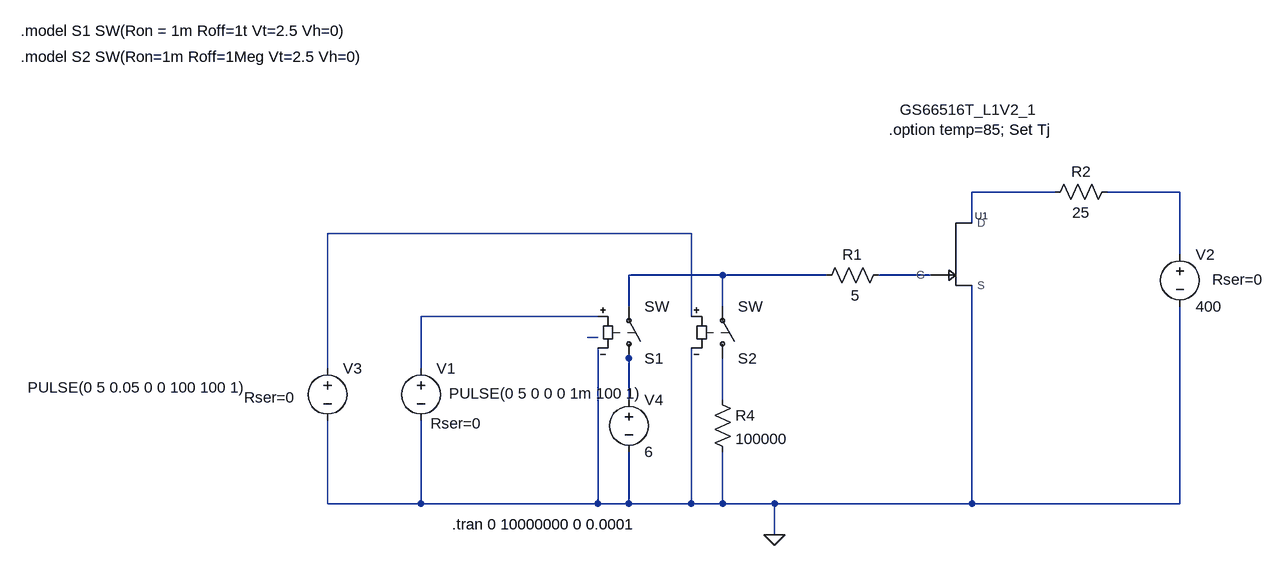
[diagram p0: schematic FloatingGate.asc]
FloatingGate.asc, the LTspice schematic file:
Version 4
SHEET 1 1036 680
WIRE 704 -96 576 -96
WIRE 896 -96 784 -96
WIRE 576 -48 576 -96
WIRE 144 -32 -416 -32
WIRE 896 0 896 -96
WIRE 192 32 48 32
WIRE 352 32 192 32
WIRE 512 32 432 32
WIRE 48 80 48 32
WIRE 192 80 192 32
WIRE 0 96 -272 96
WIRE 144 96 144 -32
WIRE 0 128 -16 128
WIRE 48 160 48 144
WIRE -416 176 -416 -32
WIRE -272 176 -272 96
WIRE 48 224 48 160
WIRE 192 224 192 160
WIRE -416 384 -416 256
WIRE -272 384 -272 256
WIRE -272 384 -416 384
WIRE 0 384 0 144
WIRE 0 384 -272 384
WIRE 48 384 48 304
WIRE 48 384 0 384
WIRE 144 384 144 144
WIRE 144 384 48 384
WIRE 192 384 192 304
WIRE 192 384 144 384
WIRE 272 384 192 384
WIRE 576 384 576 48
WIRE 576 384 272 384
WIRE 896 384 896 80
WIRE 896 384 576 384
WIRE 272 432 272 384
FLAG 272 432 0
SYMBOL GaN_E-HEMT_LT_GS66516T_L1V2_1 528 0 R0
WINDOW 3 44 -223 Center 2
SYMATTR InstName U1
SYMBOL res 448 16 R90
WINDOW 0 0 56 VBottom 2
WINDOW 3 32 52 VTop 2
SYMATTR InstName R1
SYMATTR Value 5
SYMBOL res 800 -112 R90
WINDOW 0 0 56 VBottom 2
WINDOW 3 32 56 VTop 2
SYMATTR InstName R2
SYMATTR Value 25
SYMBOL voltage -272 160 R0
WINDOW 123 0 0 Left 0
WINDOW 39 15 100 Left 2
WINDOW 3 43 54 Left 2
SYMATTR SpiceLine Rser=0
SYMATTR Value PULSE(0 5 0 0 0 1m 100 1)
SYMATTR InstName V1
SYMBOL voltage 896 -16 R0
WINDOW 123 0 0 Left 0
WINDOW 39 50 55 Left 2
SYMATTR SpiceLine Rser=0
SYMATTR InstName V2
SYMATTR Value 400
SYMBOL voltage -416 160 R0
WINDOW 123 0 0 Left 0
WINDOW 39 -128 60 Left 2
WINDOW 3 -461 45 Left 2
SYMATTR SpiceLine Rser=0
SYMATTR Value PULSE(0 5 0.05 0 0 100 100 1)
SYMATTR InstName V3
SYMBOL sw 48 176 M180
SYMATTR InstName S1
SYMATTR SpiceModel S1
SYMBOL sw 192 176 M180
SYMATTR InstName S2
SYMATTR SpiceModel S2
SYMBOL voltage 48 208 R0
WINDOW 123 0 0 Left 0
WINDOW 39 24 124 Left 2
SYMATTR InstName V4
SYMATTR Value 6
SYMBOL res 176 208 R0
SYMATTR InstName R4
SYMATTR Value 100000
TEXT 448 -192 Left 2 !.option temp=85; Set Tj
TEXT -224 416 Left 2 !.tran 0 10000000 0 0.0001
TEXT -888 -344 Left 2 !.model S1 SW(Ron = 1m Roff=1t Vt=2.5 Vh=0)
TEXT -888 -304 Left 2 !.model S2 SW(Ron=1m Roff=1Meg Vt=2.5 Vh=0)

The netlist it stands for:
* FloatingGate.asc
XU1 N005 N001 0 GS66516T_L1V2_1  ; pins G D S
R1 N005 N004 5
R2 N002 N001 25
V1 N006 0 PULSE(0 5 0 0 0 1m 100 1) Rser=0
V2 N002 0 400 Rser=0
V3 N003 0 PULSE(0 5 0.05 0 0 100 100 1) Rser=0
S1 N008 N004 N006 0 S1 SW
S2 N009 N004 N003 0 S2 SW
V4 N008 0 6
R4 N009 0 100000
.option temp=85; Set Tj
.tran 0 10000000 0 0.0001
.model S1 SW(Ron = 1m Roff=1t Vt=2.5 Vh=0)
.model S2 SW(Ron=1m Roff=1Meg Vt=2.5 Vh=0)
.lib GaN_LTspice_GS66516T_L1V2_1.lib
.backanno
.end